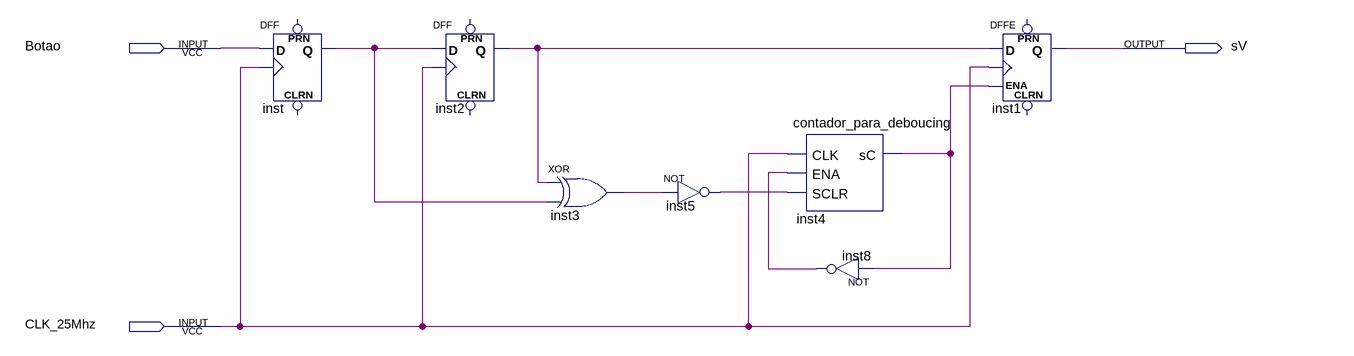
[diagram p0: schematic sheet]
// Quartus schematic debouncer.bdf as structural Verilog: 7 symbols, 3 pins
module debouncer (
  input  Botao,
  input  CLK_25Mhz,
  output sV
);

  wire inst2_q, inst3_out, inst4_sc, inst5_out, inst8_out, inst_q;

  DFF inst (.CLK(CLK_25Mhz), .D(Botao), .Q(inst_q));  // open: CLRN, PRN
  DFF inst2 (.CLK(CLK_25Mhz), .D(inst_q), .Q(inst2_q));  // open: CLRN, PRN
  xor inst3 (inst3_out, inst2_q, inst_q);
  not inst5 (inst5_out, inst3_out);
  contador_para_deboucing inst4 (.CLK(CLK_25Mhz), .ENA(inst8_out), .SCLR(inst5_out), .sC(inst4_sc));
  not inst8 (inst8_out, inst4_sc);
  DFFE inst1 (.D(inst2_q), .CLK(CLK_25Mhz), .ENA(inst4_sc), .Q(sV));  // open: PRN, CLRN
endmodule
